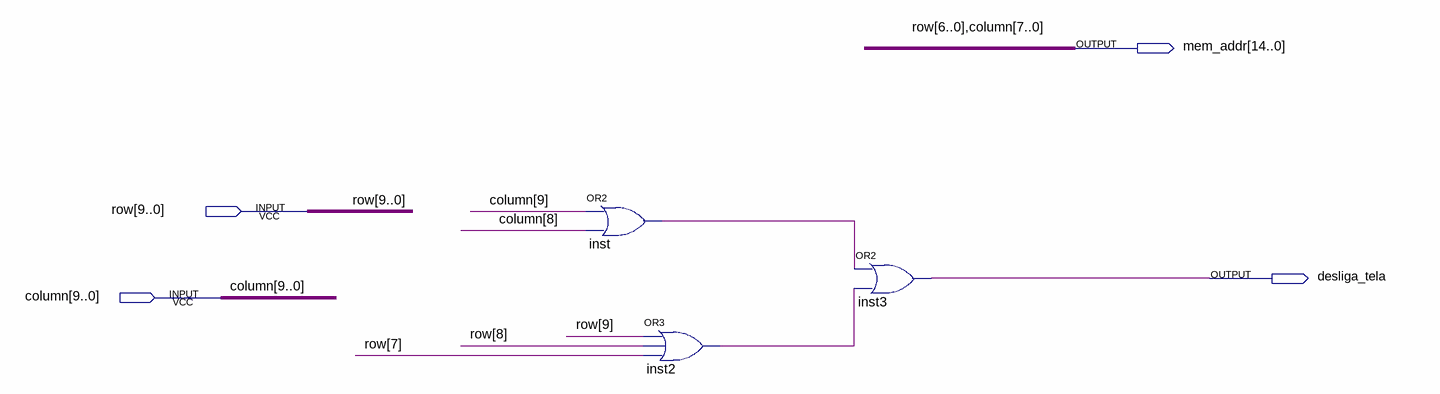
[diagram p0: schematic sheet]
// Quartus schematic controller.bdf as structural Verilog: 3 symbols, 4 pins
module controller (
  input  [9:0] row,
  input  [9:0] column,
  output [14:0] mem_addr,
  output desliga_tela
);

  wire inst2_out, inst_out;

  or inst (inst_out, column[9], column[8]);
  or inst2 (inst2_out, row[9], row[8], row[7]);
  or inst3 (desliga_tela, inst_out, inst2_out);

  assign mem_addr = {row[6:0], column[7:0]};
endmodule
